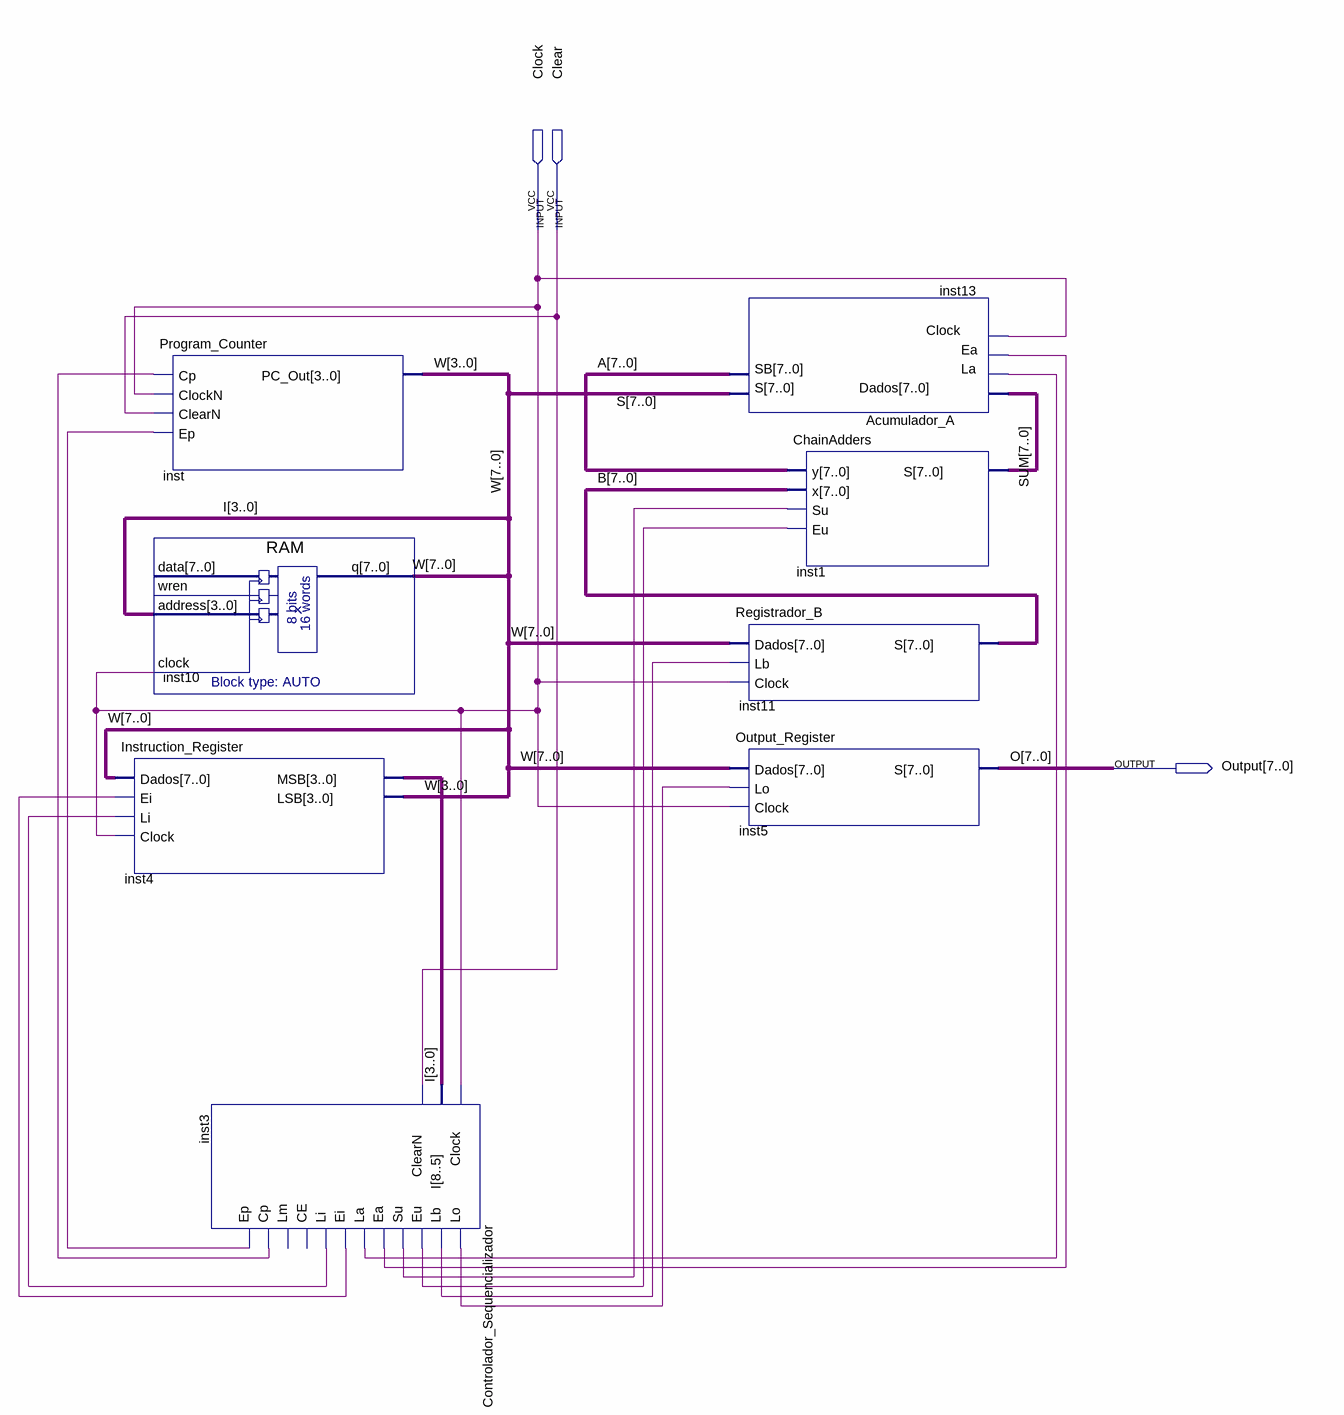
[diagram p0: schematic sheet]
// Quartus schematic Micro_Computador.bdf as structural Verilog: 8 symbols, 3 pins
module Micro_Computador (
  input  Clock,
  input  Clear,
  output [7:0] Output
);

  wire inst3_cp, inst3_ea, inst3_ei, inst3_ep, inst3_eu, inst3_la, inst3_lb, inst3_li, inst3_lo, inst3_su;
  wire [3:0] I;
  wire [7:0] A, B, S, SUM, W;

  Instruction_Register inst4 (.Dados(W), .Ei(inst3_ei), .Li(inst3_li), .Clock(Clock), .MSB(I), .LSB(W[3:0]));
  Program_Counter inst (.Cp(inst3_cp), .ClockN(Clock), .ClearN(Clear), .Ep(inst3_ep), .PC_Out(W[3:0]));
  RAM inst10 (.address(I), .clock(Clock), .q(W));  // open: data, wren
  Controlador_Sequencializador inst3 (
    .Clock(Clock), .I(I), .ClearN(Clear), .Lo(inst3_lo), .Lb(inst3_lb), .Eu(inst3_eu), .Su(inst3_su),
    .Ea(inst3_ea), .La(inst3_la), .Ei(inst3_ei), .Li(inst3_li), .Cp(inst3_cp), .Ep(inst3_ep));  // open: CE, Lm
  Acumulador_A inst13 (.Dados(SUM), .La(inst3_la), .Ea(inst3_ea), .Clock(Clock), .S(S), .SB(A));
  Registrador_B inst11 (.Dados(W), .Lb(inst3_lb), .Clock(Clock), .S(B));
  Output_Register inst5 (.Dados(W), .Lo(inst3_lo), .Clock(Clock), .S(Output));
  ChainAdders inst1 (.y(A), .x(B), .Su(inst3_su), .Eu(inst3_eu), .S(SUM));

  // Other names for the same wires on the sheet: O[7:0] = Output
endmodule
